# EAGLE design SHIELD_PICO_SMD (EAGLE 9.6.2)
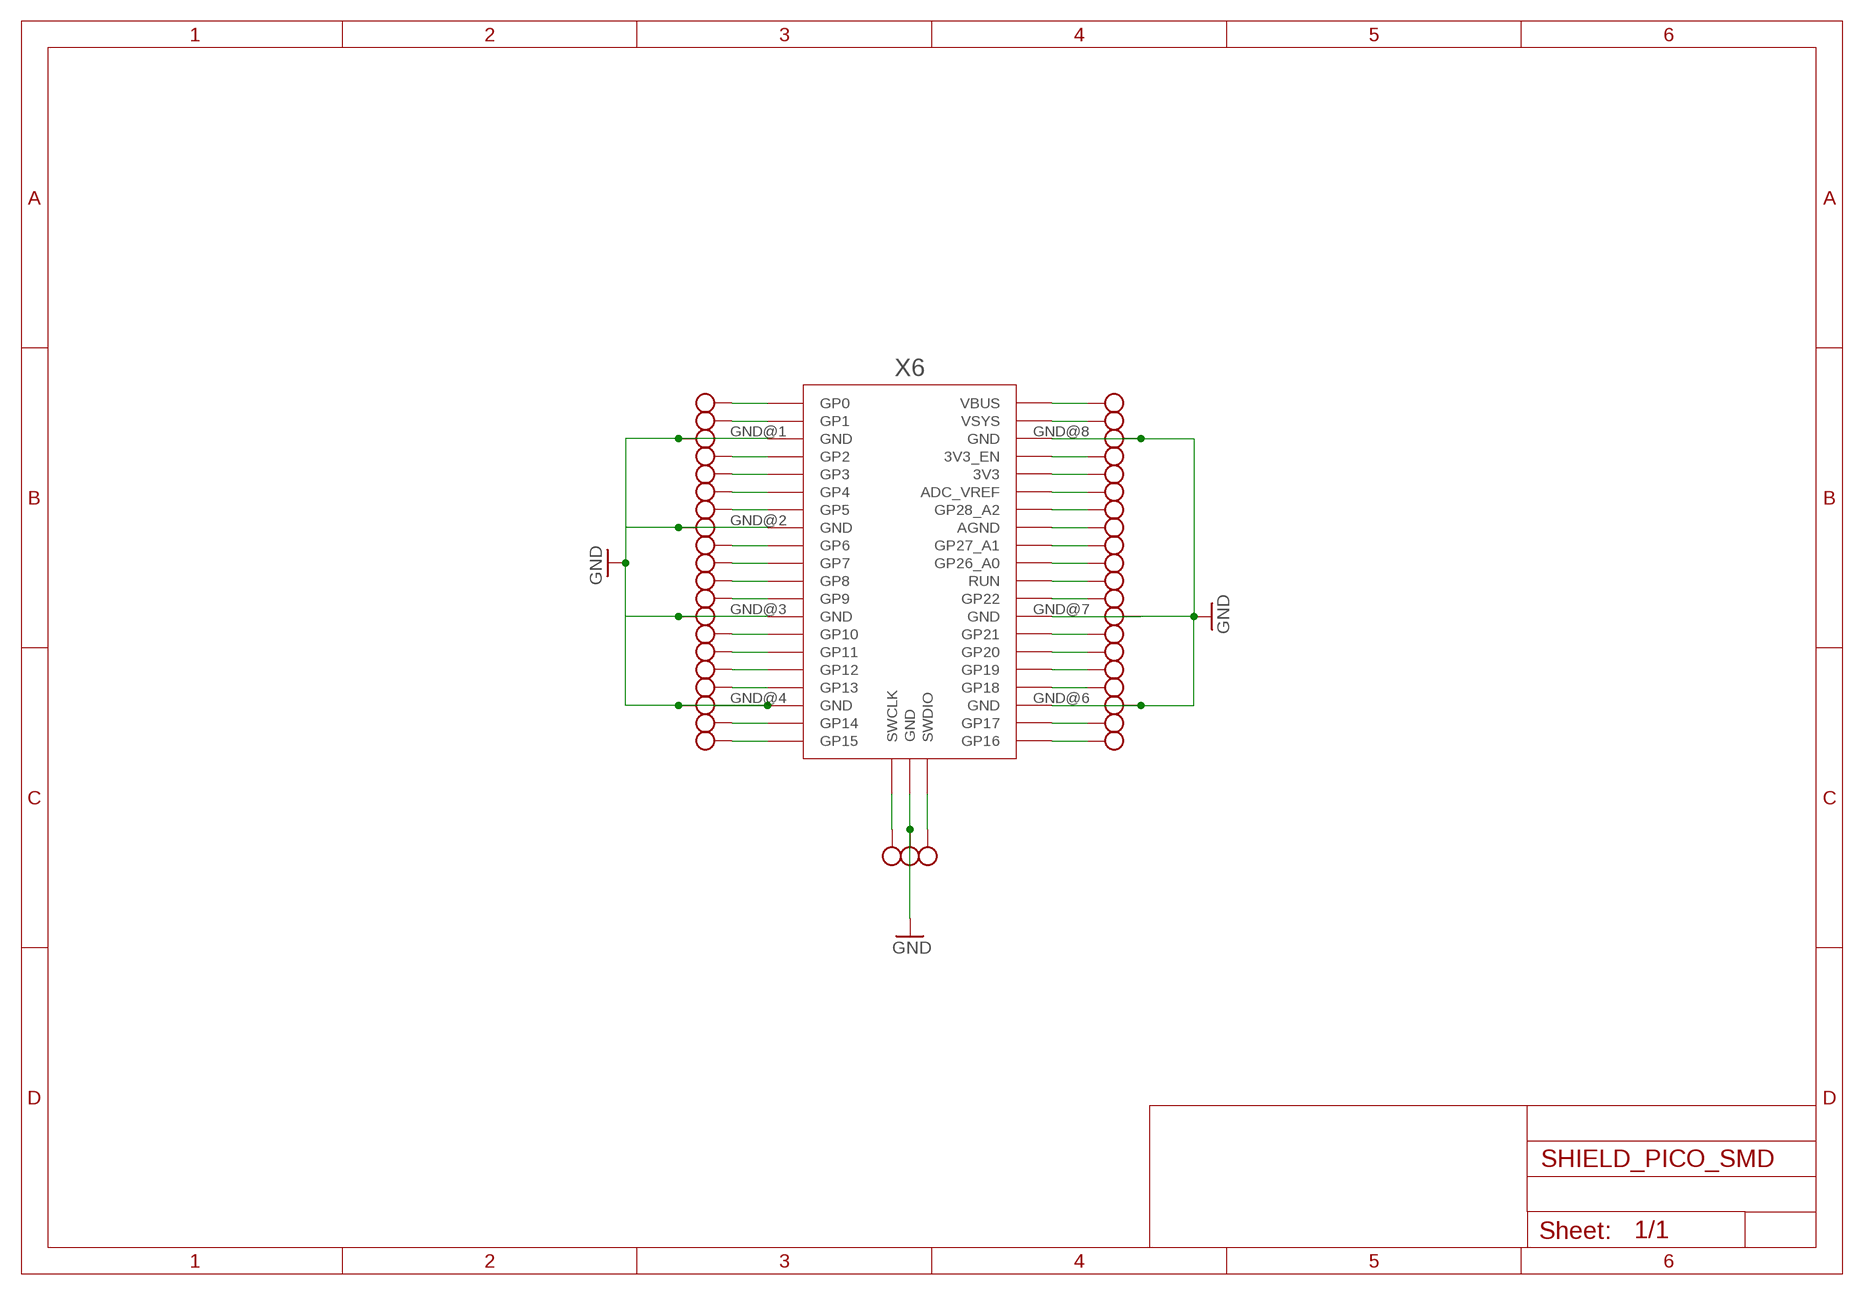
[diagram p0: schematic, sheet 1]

## Parts
X1  AK300/12  [AK300/12]
X2  AK300/8  [AK300/8]
X3  AK300/12  [AK300/12]
X4  AK300/8  [AK300/8]
X5  AK300/3  [AK300/3]
X6  RPI_PICO_IG-SMD  [RPI_PICO]

## Nets
GND: X1.5 X1.10 X2.3 X2.8 X3.3 X4.1 X4.6 X5.2 X6.GND@1(GND) X6.GND@2(GND) X6.GND@3(GND) X6.GND@4(GND) X6.GND@5(GND) X6.GND@6(GND) X6.GND@7(GND) X6.GND@8(GND)
N$1: X1.12 X6.GP0
N$2: X1.11 X6.GP1
N$3: X1.9 X6.GP2
N$4: X1.8 X6.GP3
N$5: X1.7 X6.GP4
N$6: X1.6 X6.GP5
N$7: X1.4 X6.GP6
N$8: X1.3 X6.GP7
N$9: X1.2 X6.GP8
N$10: X1.1 X6.GP9
N$11: X2.7 X6.GP10
N$12: X2.6 X6.GP11
N$13: X2.5 X6.GP12
N$14: X2.4 X6.GP13
N$15: X2.2 X6.GP14
N$16: X2.1 X6.GP15
N$17: X3.1 X6.VBUS
N$18: X3.2 X6.VSYS
N$19: X3.4 X6.3V3_EN
N$20: X3.5 X6.3V3
N$21: X3.6 X6.ADC_VREF
N$22: X3.7 X6.GP28_A2
N$23: X3.8 X6.AGND
N$24: X3.9 X6.GP27_A1
N$25: X3.10 X6.GP26_A0
N$26: X3.11 X6.RUN
N$27: X3.12 X6.GP22
N$28: X4.2 X6.GP21
N$29: X4.3 X6.GP20
N$30: X4.4 X6.GP19
N$31: X4.5 X6.GP18
N$32: X4.7 X6.GP17
N$33: X4.8 X6.GP16
N$34: X5.3 X6.SWCLK
N$36: X5.1 X6.SWDIO

## Library data of the parts
X1 X3 = con-ptr500:AK300/12: CONNECTOR; OC_FARNELL: unknown; OC_NEWARK: unknown
X2 X4 = con-ptr500:AK300/8: CONNECTOR; OC_FARNELL: unknown; OC_NEWARK: unknown
X5 = con-ptr500:AK300/3: CONNECTOR; OC_FARNELL: unknown; OC_NEWARK: unknown
X6 = RASPBERRYPI_PICO:RPI_PICO_IG

## Board
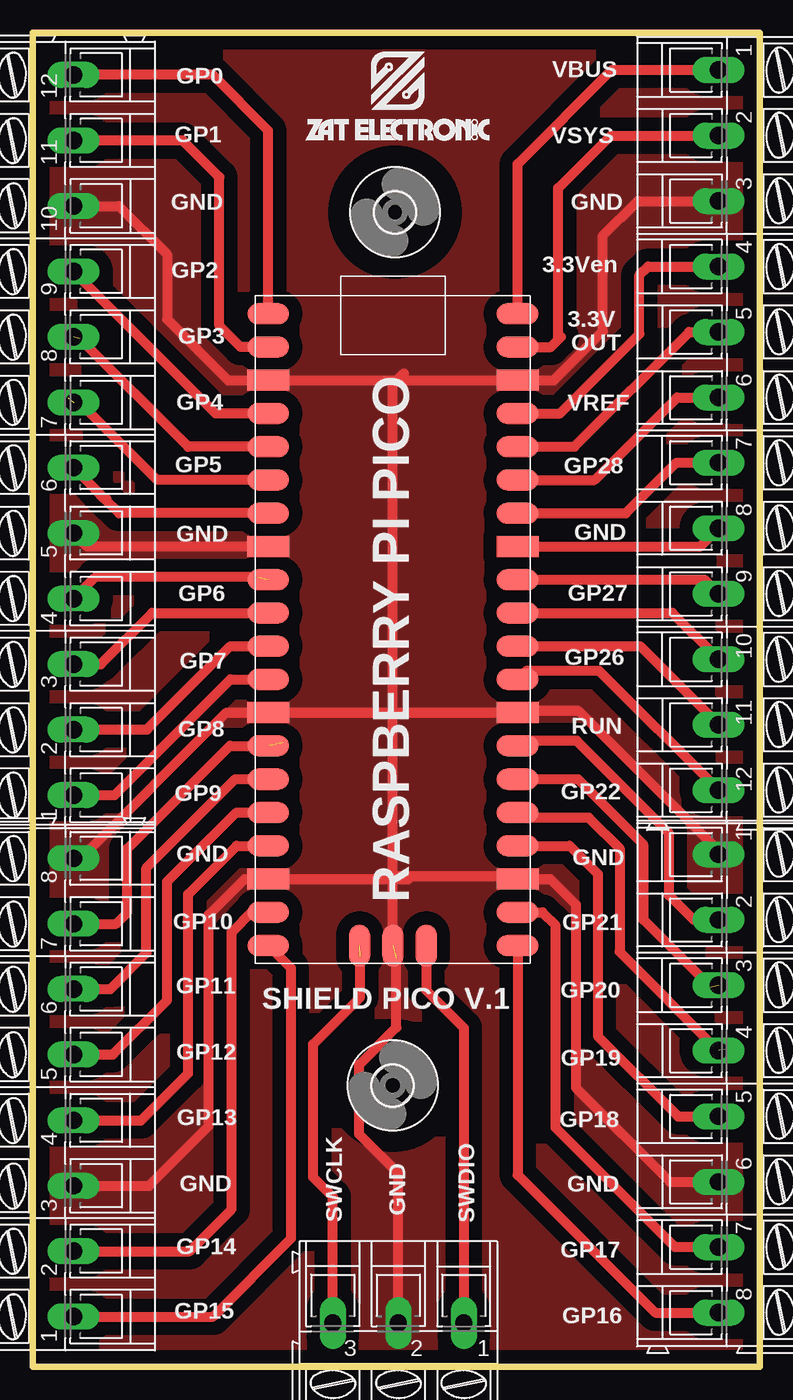
[diagram p1: board, top side]

Size 55.52 x 101.9 mm. Coordinates in mm from the lower left corner, seen from the top.
Outline: 0,101.9 0,0 55.52,0 55.52,101.9 0,101.9
Copper layers (1*16): Top 0.035mm / dielectric 1.5mm / Bottom 0.035mm
Design rules "default *": minimum track width 30mil, minimum drill 0.35mm, track to track 10mil, track to pad 10mil, pad to pad 10mil, via to via 10mil, smd to smd 40mil, copper to edge 10mil, drill to drill 10mil, minimum pad ring 10mil, minimum via ring 8mil, stop-mask expansion 4mil, vias tented up to drill 0mil, thermal gap 20mil

### Footprints (pad centres in the part's own frame; a part is rotated, then mirrored left to right if it is on the bottom)
3,0 = hole 3: 0,0
AK300/12 = drill 1.321 long: 1 -27.508,0; 2 -22.504,0; 3 -17.501,0; 4 -12.497,0; 5 -7.493,0; 6 -2.489,0; 7 2.489,0; 8 7.493,0; 9 12.497,0; 10 17.501,0; 11 22.504,0; 12 27.508,0
AK300/8 = drill 1.321 long: 1 -17.501,0; 2 -12.497,0; 3 -7.518,0; 4 -2.515,0; 5 2.515,0; 6 7.518,0; 7 12.497,0; 8 17.501,0
AK300/3 = drill 1.321 long: 1 -5.004,0; 2 0,0; 3 5.004,0
RPI_PICO = smd 3.2 x 1.6: 3V3 9.525,13.97; 3V3_EN 9.525,16.51; ADC_VREF 9.525,11.43; AGND 9.525,6.35; GND@1 -9.525,19.05; GND@2 -9.525,6.35; GND@3 -9.525,-6.35; GND@4 -9.525,-19.05; GND@6 9.525,-19.05; GND@7 9.525,-6.35; GND@8 9.525,19.05; GP0 -9.525,24.13; GP1 -9.525,21.59; GP2 -9.525,16.51; GP3 -9.525,13.97; GP4 -9.525,11.43; GP5 -9.525,8.89; GP6 -9.525,3.81; GP7 -9.525,1.27; GP8 -9.525,-1.27; GP9 -9.525,-3.81; GP10 -9.525,-8.89; GP11 -9.525,-11.43; GP12 -9.525,-13.97; GP13 -9.525,-16.51; GP14 -9.525,-21.59; GP15 -9.525,-24.13; GP16 9.525,-24.13; GP17 9.525,-21.59; GP18 9.525,-16.51; GP19 9.525,-13.97; GP20 9.525,-11.43; GP21 9.525,-8.89; GP22 9.525,-3.81; GP26_A0 9.525,1.27; GP27_A1 9.525,3.81; GP28_A2 9.525,8.89; RUN 9.525,-1.27; VBUS 9.525,24.13; VSYS 9.525,21.59 | smd 1.6 x 3.2: GND@5 0,-24.13; SWCLK -2.54,-24.13; SWDIO 2.54,-24.13

### Placement (x,y rotation side)
U$2  [3,0]  27.48,21.49 0 top
U$3  [3,0]  27.66,88.19 0 top
U$4  [LOGO_ESCRITA_MEDIO]  20.62,93.42 0 top
X1  3.12,71.17 90 top
X2  3.12,21.34 90 top
X3  52.37,71.55 270 top
X4  52.37,21.64 270 top
X5  27.91,3.35 180 top
X6  27.51,56.31 0 top

### Tracks (layer width: path | path; a pad name or v marks a point on that pad's centre or on a via)
GND  (1 unrouted)
  Top 0.762: 37.54,75.23 37.41,75.36 X6.GND@1 14.91,75.36 10.26,80.01 10.26,84.99 6.58,88.67 X1.10 | X6.GND@5 27.51,37.44 | 27.51,37.44 27.51,75.06 28.35,75.89 | X6.GND@8 39.8,75.36 43.54,79.1 43.54,86.39 46.2,89.05 X3.3 | X4.1 52.38,39.4 41.68,50.09 37.16,50.09 X6.GND@7 X6.GND@3 14.78,49.96 3.66,38.84 X2.8 | X5.2 27.92,14.77 24.92,17.77 24.92,23.08 27.76,25.92 27.76,31.19 | X4.6 48.67,14.12 41.48,21.31 41.48,35.31 39.52,37.26 X6.GND@6 36.86,37.44 28.85,37.44 | 28.85,37.44 27.51,37.44 | X2.3 8.87,13.82 13.44,18.39 13.44,34.52 16.18,37.26 X6.GND@4 28.68,37.26 28.85,37.44 | X6.GND@2 4.14,62.66 X1.5
  pour Top (isolate 1.016, no thermals): 13.03,102.06 0.15,102.06 0.15,100.86 0.15,0.2 55.4,0.2 55.4,102.06
N$1
  Top 0.762: X6.GP0 17.98,94.44 13.74,98.68 X1.12
N$2
  Top 0.762: X6.GP1 15.88,77.9 14.25,79.53 14.25,90.88 11.45,93.67 X1.11
N$3
  Top 0.762: X6.GP2 13.97,72.82 X1.9
N$4  (1 unrouted)
  Top 0.762: X6.GP3 11.86,70.28 3.61,78.54
N$5  (1 unrouted)
  Top 0.762: X6.GP4 9.5,67.74 3.23,74.02 2.69,74.02
N$6
  Top 0.762: X1.6 4.69,67.12 5.51,66.29 | 5.51,66.29 5.61,66.29 | X6.GP5 6.6,65.2 5.51,66.29
N$7  (1 unrouted)
  Top 0.762: 17.17,60.32 4.77,60.32 X1.4
N$8
  Top 0.762: X1.3 5.21,53.67 9.12,57.58 X6.GP7
N$9
  Top 0.762: X1.2 8.71,48.67 15.09,55.04 X6.GP8
N$10
  Top 0.762: X1.1 6.25,43.66 15.09,52.5 X6.GP9
N$11  (1 unrouted)
  Top 0.762: X2.7 6.38,33.83 7.21,34.67 7.21,39.57 15.06,47.42 18.9,47.42 19.15,47.68
N$12
  Top 0.762: X2.6 5.94,28.85 8.69,31.6 8.69,38.1 15.47,44.88 X6.GP11
N$13
  Top 0.762: X2.5 6.12,23.85 10.26,27.99 10.26,37.06 15.55,42.34 X6.GP12
N$14
  Top 0.762: X2.4 8.28,18.82 11.86,22.4 11.86,36.09 15.57,39.8 X6.GP13
N$15
  Top 0.762: X2.2 11.99,8.84 15.19,12.04 15.19,33.2 16.76,34.77 17.93,34.77 X6.GP14
N$16
  Top 0.762: X6.GP15 19.71,30.45 19.71,9.78 13.77,3.84 X2.1
N$17
  Top 0.762: X6.VBUS 37.03,91.87 44.22,99.06 X3.1
N$18
  Top 0.762: X6.VSYS 39.57,77.9 40.12,78.45 | 40.12,78.45 40.33,78.66 | 40.12,78.45 40.12,90.03 44.14,94.06 X3.2
N$19
  Top 0.762: X6.3V3_EN 40.26,72.82 46.33,78.89 46.33,83.39 46.99,84.05 X3.4
N$20
  Top 0.762: X6.3V3 41.35,70.28 50.11,79.04 X3.5
N$21
  Top 0.762: X6.ADC_VREF 42.9,67.74 49.2,74.04 X3.6
N$22
  Top 0.762: X6.GP28_A2 45.29,65.2 49.15,69.06 X3.7
N$23
  Top 0.762: X6.AGND 50.98,62.66 X3.8
N$24
  Top 0.762: X6.GP27_A1 51.31,60.12 X3.9
N$25
  Top 0.762: X6.GP26_A0 48.84,57.58 X3.10
N$26
  Top 0.762: X6.RUN 46.38,55.04 X3.11
N$27
  Top 0.762: X6.GP22 37.69,53.16 43.26,53.16 X3.12
N$28
  Top 0.762: X6.GP21 37.41,47.8 41.55,47.8 48.56,40.79 48.56,36.04 50.47,34.14 X4.2
N$29  (1 unrouted)
  Top 0.762: X6.GP20 41.63,44.88 46.61,39.9 46.61,34.16 51.77,29.01
N$30  (1 unrouted)
  Top 0.762: X6.GP19 37.44,41.94 42.47,41.94 44.81,39.6 44.81,31.7 52.25,24.26 53.01,24.26
N$31
  Top 0.762: X6.GP18 41,39.8 43.16,37.64 43.16,25.25 49.28,19.13 X4.5
N$32
  Top 0.762: X6.GP17 38.91,34.72 39.93,33.71 39.93,18.26 49.05,9.14 X4.7
N$33
  Top 0.762: X6.GP16 37.03,14.66 47.55,4.14 X4.8
N$34  (1 unrouted)
  Top 0.762: X5.3 22.91,12.98 21.41,14.48 21.41,24.64 24.99,28.22 24.99,31.32
N$36
  Top 0.762: X6.SWDIO 30.05,28.75 32.92,25.88 X5.1

### Text on the board
tNames: VBUS | GP0 | VSYS | GP1 | GND | GND | GP2 | 3.3Ven | 3.3V | GP3 | OUT | GP4 | VREF | GP5 | GP28 | GND | GND | GP6 | GP27 | GP7 | GP26 | GP8 | RUN | GP9 | GP22 | GND | GND | RASPBERRY PI PICO | GP10 | GP21 | GP11 | GP20 | SHIELD PICO V.1 | GP12 | GP19 | GP13 | GP18 | GND | GND | GND | SWCLK | SWDIO | GP14 | GP17 | GP15 | GP16